# EAGLE schematic 2364_ROM-el_v2 (EAGLE 7.7.0)
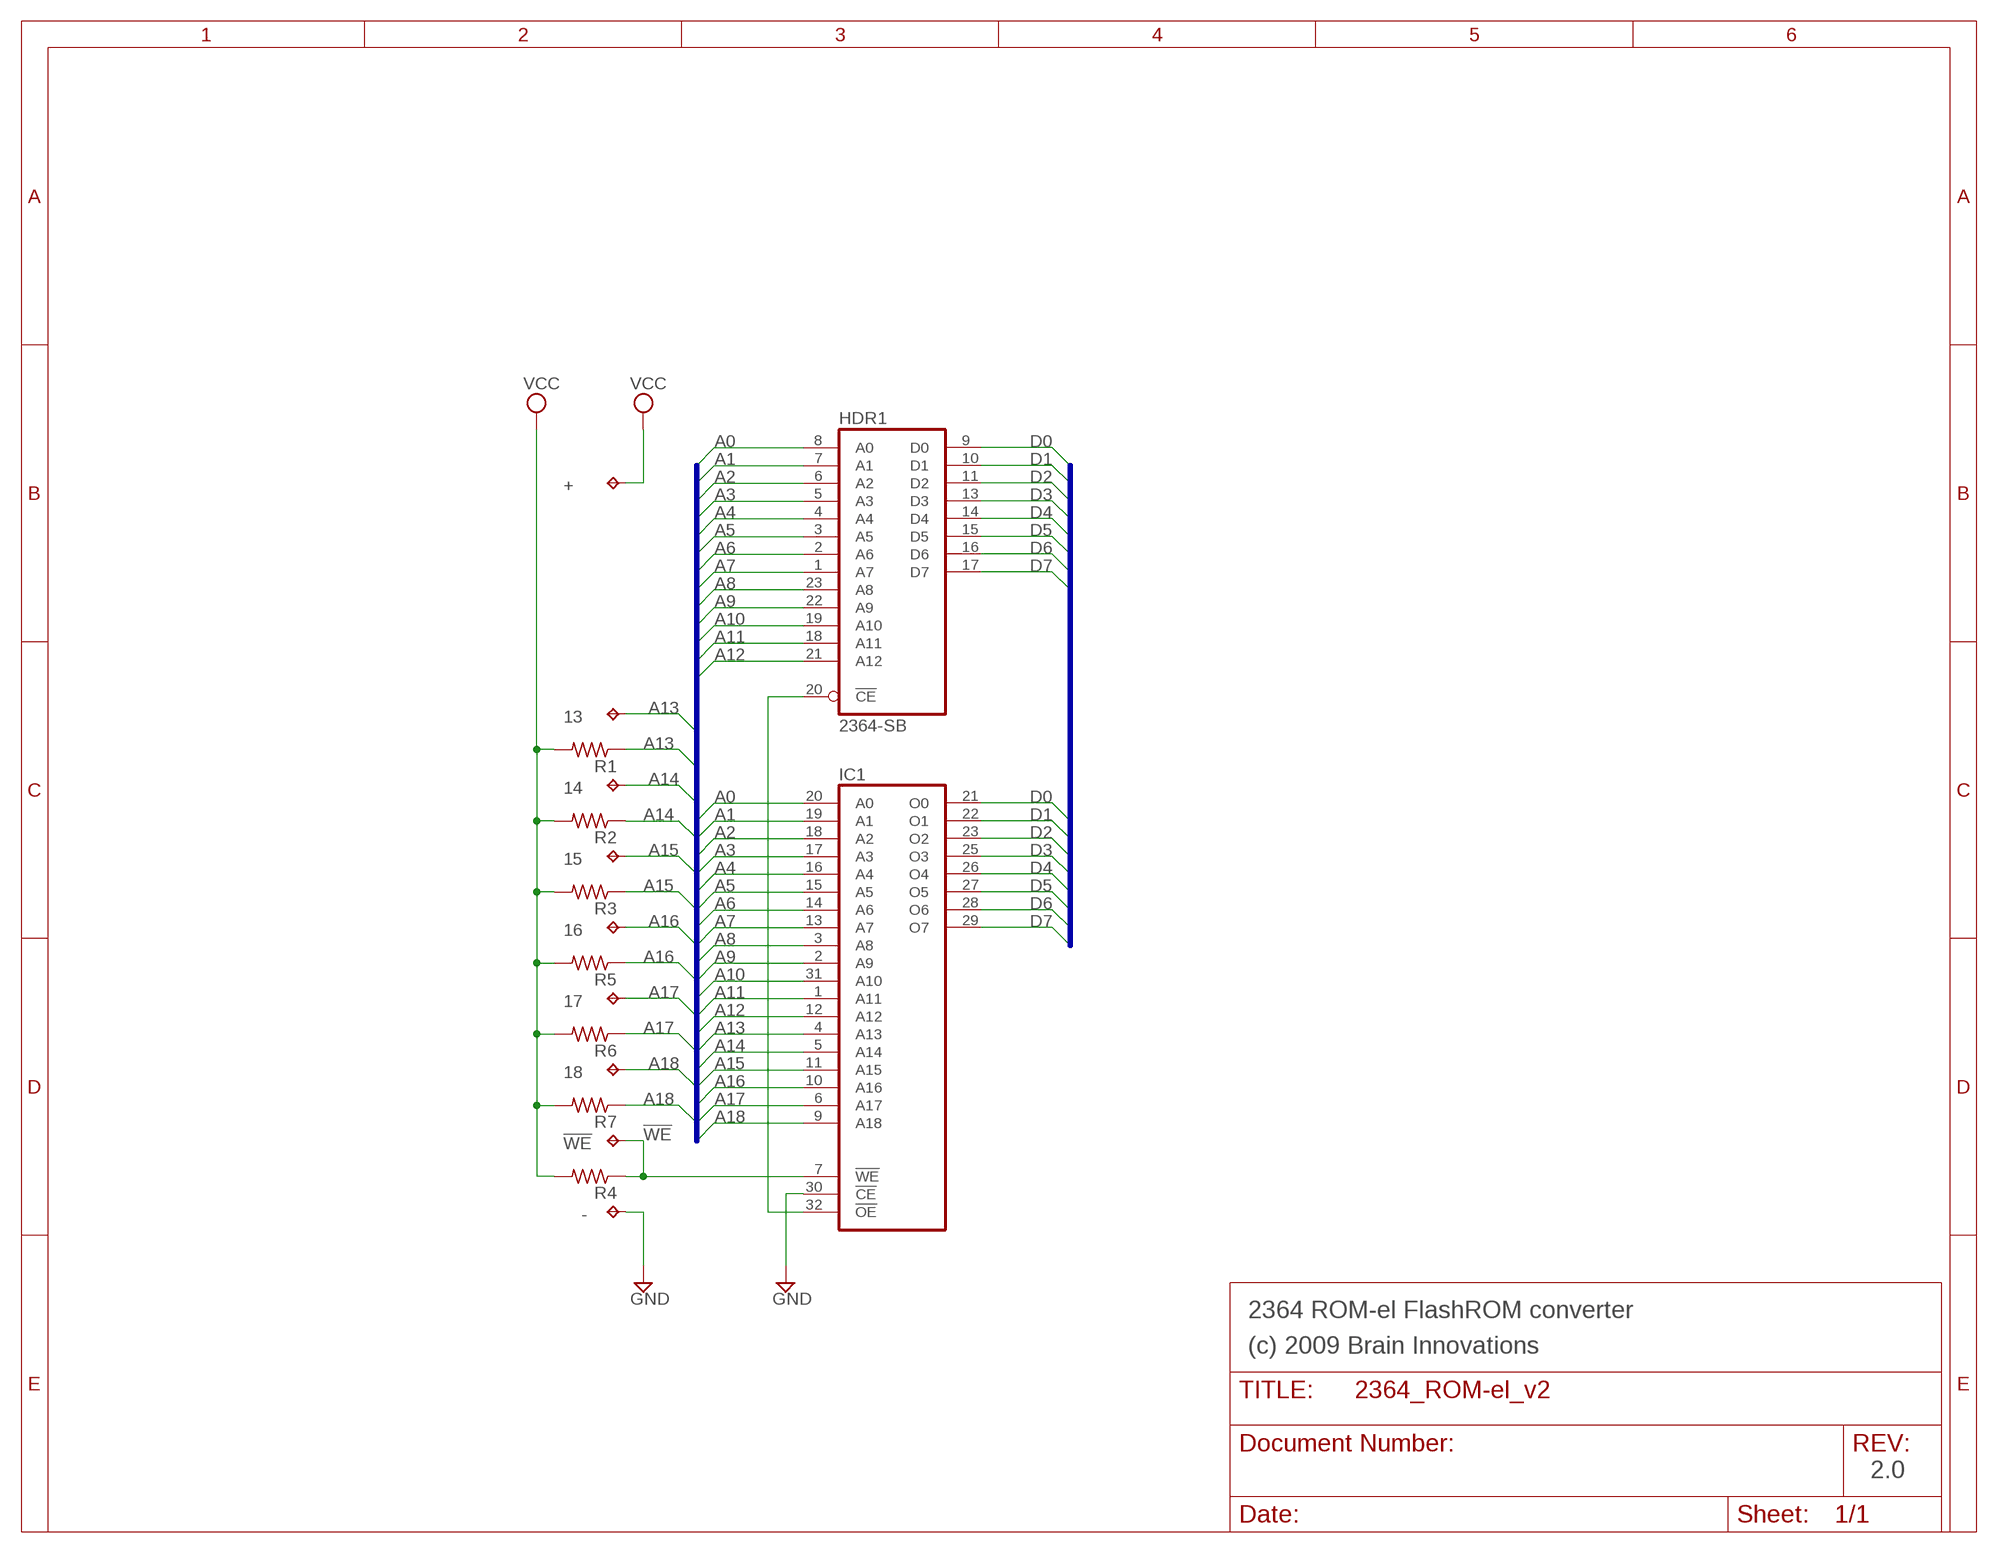
[diagram p0: schematic, sheet 1]

## Parts
13  TPTP13SQ  [TP13SQ]
14  TPTP13SQ  [TP13SQ]
15  TPTP13SQ  [TP13SQ]
16  TPTP13SQ  [TP13SQ]
17  TPTP13SQ  [TP13SQ]
18  TPTP13SQ  [TP13SQ]
!WE  TPTP13SQ  [TP13SQ]
+  TPTP13SQ  [TP13SQ]
-  TPTP13SQ  [TP13SQ]
HDR1  2364-SB  [DIL24-SMD-REVERSE]
IC1  FLASH_RAM4096KB'V'  [VSOP32]
R1  R-US_R0402  [R0402]
R2  R-US_R0402  [R0402]
R3  R-US_R0402  [R0402]
R4  R-US_R0402  [R0402]
R5  R-US_R0402  [R0402]
R6  R-US_R0402  [R0402]
R7  R-US_R0402  [R0402]

## Nets
!WE: !WE.TP IC1.7(!WE) R4.1
A0: HDR1.8(A0) IC1.20(A0)
A1: HDR1.7(A1) IC1.19(A1)
A2: HDR1.6(A2) IC1.18(A2)
A3: HDR1.5(A3) IC1.17(A3)
A4: HDR1.4(A4) IC1.16(A4)
A5: HDR1.3(A5) IC1.15(A5)
A6: HDR1.2(A6) IC1.14(A6)
A7: HDR1.1(A7) IC1.13(A7)
A8: HDR1.23(A8) IC1.3(A8)
A9: HDR1.22(A9) IC1.2(A9)
A10: HDR1.19(A10) IC1.31(A10)
A11: HDR1.18(A11) IC1.1(A11)
A12: HDR1.21(A12) IC1.12(A12)
A13: 13.TP IC1.4(A13) R1.1
A14: 14.TP IC1.5(A14) R2.1
A15: 15.TP IC1.11(A15) R3.1
A16: 16.TP IC1.10(A16) R5.1
A17: 17.TP IC1.6(A17) R6.1
A18: 18.TP IC1.9(A18) R7.1
D0: HDR1.9(D0) IC1.21(O0)
D1: HDR1.10(D1) IC1.22(O1)
D2: HDR1.11(D2) IC1.23(O2)
D3: HDR1.13(D3) IC1.25(O3)
D4: HDR1.14(D4) IC1.26(O4)
D5: HDR1.15(D5) IC1.27(O5)
D6: HDR1.16(D6) IC1.28(O6)
D7: HDR1.17(D7) IC1.29(O7)
GND: -.TP IC1.30(!CE)
N$1: HDR1.20(!CE) IC1.32(!OE)
VCC: +.TP R1.2 R2.2 R3.2 R4.2 R5.2 R6.2 R7.2

## Buses
A[0..18]
D[0..7]

## Notes on the sheet
- 2364 ROM-el FlashROM converter
- (c) 2009 Brain Innovations
- 2.0

## Power pins joined to a net without a drawn wire
GND: HDR1.12(GND) IC1.24(GND)
VCC: HDR1.24(VCC) IC1.8(VCC)

## Library data of the parts
13-18 !WE + - = testpad:TP: Test pad
HDR1 = commodore:2364
IC1 = memory-jedec:FLASH_RAM4096KB
R1-R7 = resistor:R-US_: RESISTOR, American symbol